# Altium project Mach_dieu khien tu xa 4 lop.PrjPcb
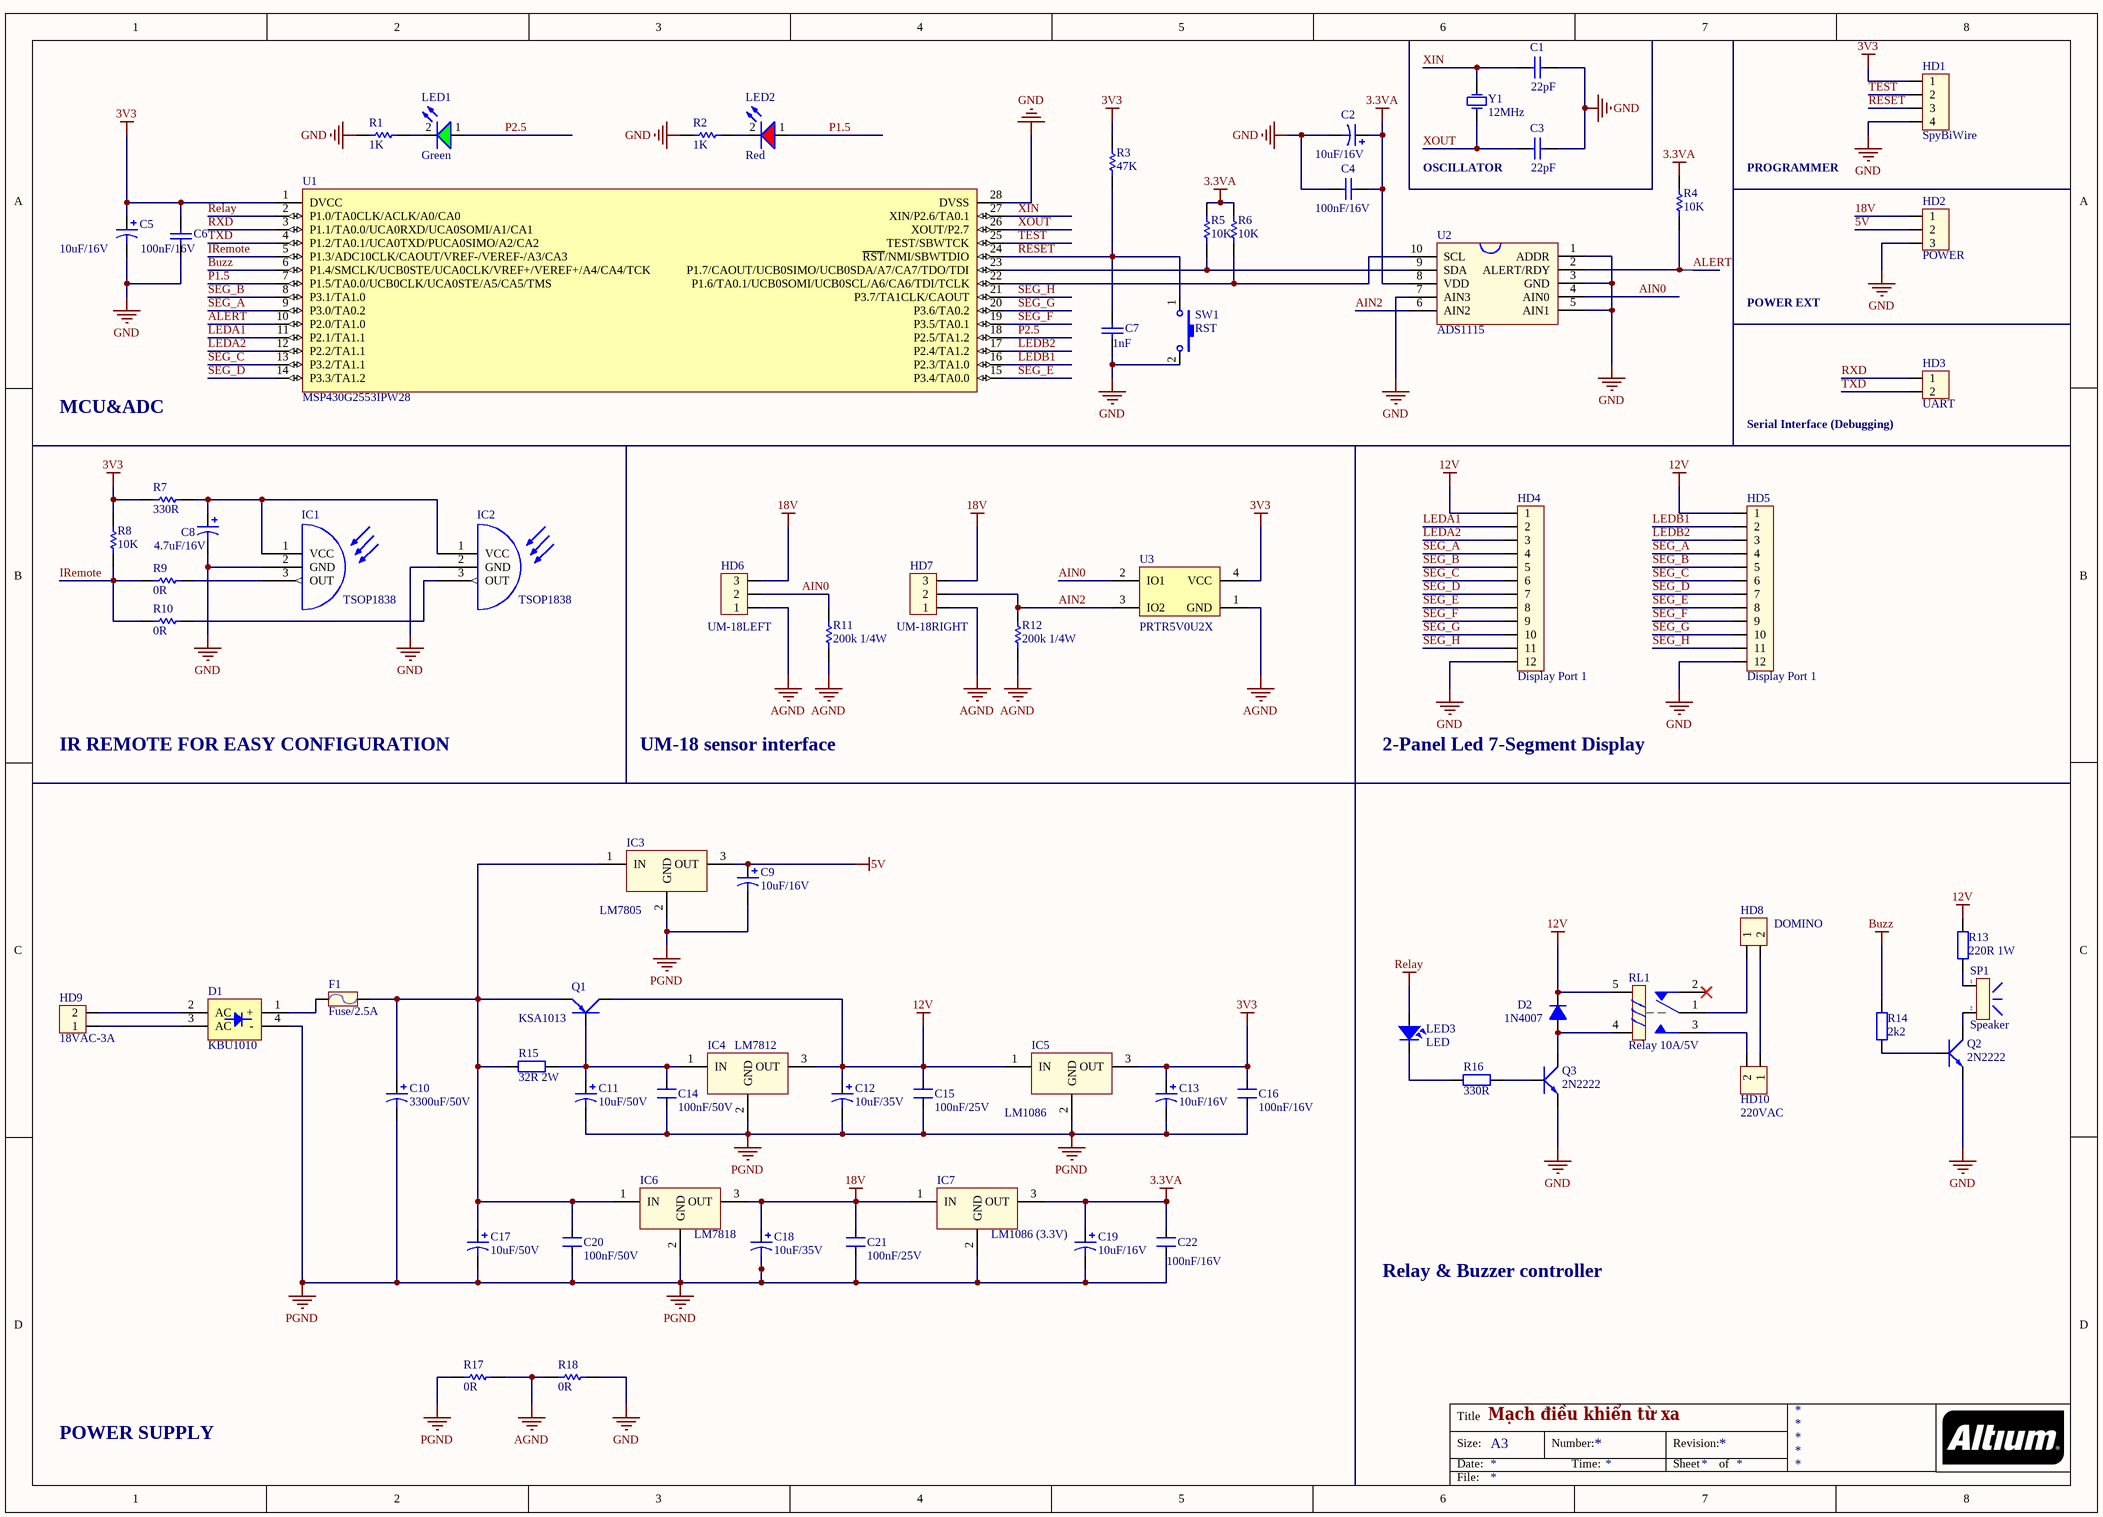
[diagram p0: Sheet1.SchDoc]
1 sheet, 73 parts. Net scope: global (net labels, ports and power ports of the same name join across sheets).
Board file: PCB1.PcbDoc

## Sheet Sheet1.SchDoc: Mạch điều khiển từ xa
size A3

### Parts
C1  22pF  [Tu gom 104]
C2  10uF/16V  [CAP_22UF_16V]
C3  22pF  [Tu gom 104]
C4  100nF/16V  [C0_1uF]
C5  10uF/16V  [CP_1]
C6  100nF/16V  [Tu gom 104]
C7  1nF  [Tu gom 104]
C8  4.7uF/16V  [CP_1]
C9  value 10uF/16V  [CP_1]  (hidden comment: Cap Pol1)
C10  value 3300uF/50V  [CAP_470UF_25V]  (hidden comment: Cap Pol1)
C11  value 10uF/50V  [CP_1]  (hidden comment: Cap Pol1)
C12  value 10uF/35V  [CP_1]  (hidden comment: Cap Pol1)
C13  value 10uF/16V  [CP_1]  (hidden comment: Cap Pol1)
C14  100nF/50V  [Tu gom 104]
C15  100nF/25V  [Tu gom 104]
C16  100nF/16V  [Tu gom 104]
C17  value 10uF/50V  [CP_1]  (hidden comment: Cap Pol1)
C18  value 10uF/35V  [CP_1]  (hidden comment: Cap Pol1)
C19  value 10uF/16V  [CP_1]  (hidden comment: Cap Pol1)
C20  100nF/50V  [Tu gom 104]
C21  100nF/25V  [Tu gom 104]
C22  100nF/16V  [Tu gom 104]
D1  KBU1010  [BRIDGE-10A]
D2  1N4007  [D2A]
F1  Fuse/2.5A  [FUSE2_5A]
HD1  SpyBiWire  [Header_4]
HD2  POWER  [HD-3]
HD3  UART  [HD2]
HD4  Display Port 1  [HD-12]
HD5  Display Port 1  [HD-12]
HD6  UM-18LEFT  [Header_3]
HD7  UM-18RIGHT  [Header_3]
HD8  DOMINO  [HDR-2GREEN]
HD9  18VAC-3A  [HDR-2GREEN]
HD10  220VAC  [HDR-2GREEN]
IC1  TSOP1838  [TSOP-1838]
IC2  TSOP1838  [TSOP-1838]
IC3  LM7805  [TO-220]
IC4  LM7812  [TO-220]
IC5  LM1086  [TO-220]
IC6  LM7818  [TO-220]
IC7  LM1086 (3.3V)  [TO-220]
LED1  value Green  [LED_0805_GREEN]  (hidden comment: LED_G_3)
LED2  value Red  [LED_0805_RED]  (hidden comment: LED_R_5)
LED3  LED  [LED_BLUE_5mm]
Q1  KSA1013  [TO92]
Q2  2N2222  [TO92]
Q3  2N2222  [TO92]
R1  1K  [R1/2W]
R2  1K  [R1/2W]
R3  47K  [R1/4W]
R4  10K  [R1/2W]
R5  10K  [R1/2W]
R6  10K  [R1/2W]
R7  330R  [R_0805]
R8  10K  [R1/2W]
R9  0R  [R1W]
R10  0R  [R1W]
R11  200k 1/4W  [R1/4W]
R12  200k 1/4W  [R1/4W]
R13  value 220R 1W  [R_0805]  (hidden comment: Res2)
R14  value 2k2  [R1/2W]  (hidden comment: Res2)
R15  value 32R 2W  [R_0805]  (hidden comment: Res2)
R16  value 330R  [R_0805]  (hidden comment: Res2)
R17  0R  [R1W]
R18  0R  [R1W]
RL1  Relay 10A/5V  [RL_SPDT_10A]
SP1  Speaker  [SPEAKER]
SW1  value RST  [SW-SMD]  (hidden comment: EVQ-PNF04M)
U1  MSP430G2553IPW28  [TSSOP-28]
U2  ADS1115  [TSSOP-10]
U3  PRTR5V0U2X  [SOT-143]
Y1  value 12MHz  [XTAL-12MHz]  (hidden comment: HC49S-20-C-30-30-F-20.000MHz)

### Nets
3.3VA: C2.1 C4.2 C19.1 C22.2 IC7.3(OUT) R4.2 R5.2 R6.2 U2.8(VDD)
3V3: C5.1 C6.2 C13.1 C16.2 HD1.1 IC5.3(OUT) R3.2 R7.1 R8.2 U1.1(DVCC) U3.4(VCC)
5V: C9.1 HD2.2 IC3.3(OUT)
12V: C12.1 C15.2 D2.2(K) HD4.1 HD5.1 IC4.3(OUT) IC5.1(IN) Q1.2(C) R13.2 RL1.5
18V: C18.1 C21.2 HD2.1 HD6.3 HD7.3 IC6.3(OUT) IC7.1(IN)
AGND: HD6.1 HD7.1 R11.1 R12.1 R17.2 R18.1 U3.1(GND)
Buzz: R14.1 U1.6(P1.4/SMCLK/UCB0STE/UCA0CLK/VREF+/VEREF+/A4/CA4/TCK)
GND: C1.2 C2.2 C3.2 C4.1 C5.2 C6.1 C7.1 C8.2 HD1.4 HD2.3 HD4.12 HD5.12 IC1.2(GND) IC2.2(GND) Q2.1(E) Q3.1(E) R1.2 R2.2 R18.2 SW1.2 U1.28(DVSS) U2.1(ADDR) U2.3(GND) U2.5(AIN1) U2.7(AIN3)
PGND: C9.2 C10.2 C11.2 C12.2 C13.2 C14.1 C15.1 C16.1 C17.2 C18.2 C19.2 C20.1 C21.1 C22.1 D1.4(-) IC3.2(GND) IC4.2(GND) IC5.2(GND) IC6.2(GND) IC7.2(GND) R17.1
Relay: LED3.1 U1.2(P1.0/TA0CLK/ACLK/A0/CA0)
AIN0: HD6.2 R11.2 U2.4(AIN0) U3.2(IO1)
AIN2: HD7.2 R12.2 U2.6(AIN2) U3.3(IO2)
ALERT: R4.1 U1.10(P2.0/TA1.0) U2.2(ALERT/RDY)
IRemote: R8.1 R9.1 R10.1 U1.5(P1.3/ADC10CLK/CAOUT/VREF-/VEREF-/A3/CA3)
LEDA1: HD4.2 U1.11(P2.1/TA1.1)
LEDA2: HD4.3 U1.12(P2.2/TA1.1)
LEDB1: HD5.2 U1.16(P2.3/TA1.0)
LEDB2: HD5.3 U1.17(P2.4/TA1.2)
P1.5: LED2.1(A) U1.7(P1.5/TA0.0/UCB0CLK/UCA0STE/A5/CA5/TMS)
P2.5: LED1.1(A) U1.18(P2.5/TA1.2)
RESET: C7.2 HD1.3 R3.1 SW1.1 U1.24(~{RST}/NMI/SBWTDIO)
RXD: HD3.1 U1.3(P1.1/TA0.0/UCA0RXD/UCA0SOMI/A1/CA1)
SEG_A: HD4.4 HD5.4 U1.9(P3.0/TA0.2)
SEG_B: HD4.5 HD5.5 U1.8(P3.1/TA1.0)
SEG_C: HD4.6 HD5.6 U1.13(P3.2/TA1.1)
SEG_D: HD4.7 HD5.7 U1.14(P3.3/TA1.2)
SEG_E: HD4.8 HD5.8 U1.15(P3.4/TA0.0)
SEG_F: HD4.9 HD5.9 U1.19(P3.5/TA0.1)
SEG_G: HD4.10 HD5.10 U1.20(P3.6/TA0.2)
SEG_H: HD4.11 HD5.11 U1.21(P3.7/TA1CLK/CAOUT)
TEST: HD1.2 U1.25(TEST/SBWTCK)
TXD: HD3.2 U1.4(P1.2/TA0.1/UCA0TXD/PUCA0SIMO/A2/CA2)
XIN: C1.1 U1.27(XIN/P2.6/TA0.1) Y1.2(OSC2)
XOUT: C3.1 U1.26(XOUT/P2.7) Y1.1(OSC1)
NetC8_1: C8.1 IC1.1(VCC) IC2.1(VCC) R7.2
NetC10_1: C10.1 C17.1 C20.2 F1.2 IC3.1(IN) IC6.1(IN) Q1.1(E) R15.1
NetC11_1: C11.1 C14.2 IC4.1(IN) Q1.3(B) R15.2
NetD1_1: D1.1(+) F1.1
NetD1_2: D1.2(AC) HD9.2
NetD1_3: D1.3(AC) HD9.1
NetD2_1: D2.1(A) Q3.3(C) RL1.4
NetHD8_1: HD8.1 RL1.1
NetHD8_2: HD8.2 HD10.1
NetHD10_2: HD10.2 RL1.3
NetIC1_3: IC1.3(OUT) R9.2
NetIC2_3: IC2.3(OUT) R10.2
NetLED1_2: LED1.2(K) R1.1
NetLED2_2: LED2.2(K) R2.1
NetLED3_2: LED3.2 R16.2
NetQ2_2: Q2.2(B) R14.2
NetQ2_3: Q2.3(C) SP1.2
NetQ3_2: Q3.2(B) R16.1
NetR5_1: R5.1 U1.23(P1.7/CAOUT/UCB0SIMO/UCB0SDA/A7/CA7/TDO/TDI) U2.9(SDA)
NetR6_1: R6.1 U1.22(P1.6/TA0.1/UCB0SOMI/UCB0SCL/A6/CA6/TDI/TCLK) U2.10(SCL)
NetR13_1: R13.1 SP1.1

Not connected (* = marked no-connect by the designer): RL1 2*

### Notes on the sheet
- OSCILLATOR
- PROGRAMMER
- POWER EXT
- MCU&ADC
- (near HD3) Serial Interface (Debugging)
- IR REMOTE FOR EASY CONFIGURATION
- UM-18 sensor interface
- 2-Panel Led 7-Segment Display
- Relay & Buzzer controller
- POWER SUPPLY
- Title
- Size:
- Date:
- A3
- Number:
- Time:
- Revision:
- Sheet
- of
- File:

### Library data of the parts
C1 C3 C4 C6 C7 = 10nF/50V/C0603/10%: CAP CER 10000PF 50V X7R 0603; Manufacturer: Murata Electronics North America; Manufacturer Part Number: GRM188R71H103KA01D; Tolerance: ±10%; RoHS: RoHS Compliant; Category: Capacitors; Packaging: Cut Tape (CT); Capacitance: 10000pF; Voltage - Rated: 50V; Temperature Coefficient: X7R; Mounting Type: Surface Mount, MLCC; Operating Temperature: -55°C ~ 125°C; Applications: General Purpose; Ratings: -; Package / Case: 0603 (1608 Metric); Size / Dimension: 0.063" L x 0.031" W (1.60mm x 0.80mm); Height - Seated (Max): -; Thickness (Max): 0.035" (0.90mm); Lead Spacing: -; Features: -; Lead Style: -; ComponentLink1URL: http://www.murata.com/~/media/webrenewal/support/library/catalog/products/capacitor/mlcc/c02e.ashx; ComponentLink1Description: http://www.murata.com/~/media/webrenewal/support/library/catalog/products/capacitor/mlcc/c02e.ashx; Supplier 1: Digi-Key; Supplier Part Number 1: 490-1512-1-ND
C2 C5 C8 = 100uF/6.3V/SIZE B/20%: CAP TANT 100UF 6.3V 20% 1411; Manufacturer: Kemet; Manufacturer Part Number: T491B107M006AT; Manufacturer Size Code: B; Capacitance: 100µF; ESR (Equivalent Series Resistance): 3 Ohm; Type: Molded; Lifetime @ Temp.: 2000 Hrs @ 85°C; RoHS: RoHS Compliant; Category: Capacitors; Packaging: Cut Tape (CT); Tolerance: ±20%; Voltage - Rated: 6.3V; Operating Temperature: -55°C ~ 125°C; Mounting Type: Surface Mount; Package / Case: 1411 (3528 Metric); Size / Dimension: 0.138" L x 0.110" W (3.50mm x 2.80mm); Height - Seated (Max): 0.083" (2.10mm); Lead Spacing: -; Features: General Purpose; ComponentLink1URL: http://www.kemet.com/Lists/ProductCatalog/Attachments/254/KEM_T2005_T491.pdf; ComponentLink1Description: http://www.kemet.com/Lists/ProductCatalog/Attachments/254/KEM_T2005_T491.pdf; Supplier 1: Digi-Key; Supplier Part Number 1: 399-3710-1-ND
C9-C13 C17-C19 = Cap Pol1: Polarized Capacitor (Radial); Published: 8-Jun-2000; LatestRevisionDate: 17-Jul-2002; LatestRevisionNote: Re-released for DXP Platform.; PackageReference: RB7.6-15; Publisher: Altium Limited; PackageDescription: Polarized Capacitor (Radial); 2 Leads
C14-C16 C20-C22 = CN2: Cap np 104 => 105pF; Value: 0.1uF
D1 = KBU1010: 10A glass passivated bridge rectifier; Digikey: http://www.digikey.com/product-detail/en/KBU1010-G/641-1359-ND/2074824; datasheet: http://www.comchiptech.com/cms/UserFiles/KBU10005-G%20Thru.%20KBU1010-G%20Series%20RevA.pdf
D2 = D1A: Diode 1A; Value: 1N4007
F1 = Fuse: Designed by: VanDungEvn; Value: Fuse
HD1 = Hed4: Header 4 (Green); Value: Header 4
HD2 HD6 HD7 = Hed3: Header 3 (Green); Value: Header 3
HD3 HD8-HD10 = Hed2: Header 2 (Green); Value: Header 2
HD4 HD5 = Hed12: Header 12; Value: Header 5
IC3-IC5 = LM78xx: Linear Regulator; Value: LM7818; digikey: http://www.digikey.com/product-detail/en/LM7818CT/LM7818CT-ND/1923054; datasheet: http://www.fairchildsemi.com/ds/LM/LM7805.pdf
IC6 IC7 = LM78xx: Linear Regulator
  IC6: Value: LM7818; digikey: http://www.digikey.com/product-detail/en/LM7818CT/LM7818CT-ND/1923054; datasheet: http://www.fairchildsemi.com/ds/LM/LM7805.pdf
  IC7: Value: LM1086 (3.3V); digikey: http://www.digikey.com/product-detail/en/LM1086CSX-3.3%2FNOPB/LM1086CSX-3.3%2FNOPBCT-ND/3440095; datasheet: http://www.ti.com/lit/ds/symlink/lm1086.pdf
LED1 = LED_GREEN_3MM: LED Green 3mm; ComponentLink1Description: Datasheet; ComponentLink1URL: D:\Dropbox\Datasheets\Opto and Illumination\LEDs\SMD LED.pdf; Unit Price: 0.0476
LED2 = LED_RED_5MM: LED Red 5mm; ComponentLink1Description: Datasheet; ComponentLink1URL: D:\Dropbox\Datasheets\Opto and Illumination\LEDs\SMD LED.pdf; Unit Price: 0.0476
LED3 = LED: LED Single colour Green and Red; Value: LED 3 ly Single Colour
Q1 = A1015: PNP 600mW, ECB; Manufacturer: Fairchild Semiconductor; Value: KSA1013; Digikey: http://www.digikey.com/product-detail/en/KSA1013YBU/KSA1013YBUFS-ND/1048937; Datasheet: http://www.fairchildsemi.com/ds/KS/KSA1013.pdf
Q2 Q3 = C1815: TRANS GP SS NPN LP 40V TO92; Value: P2N2222AG; digikey: http://www.digikey.com/product-detail/en/P2N2222AG/P2N2222AGOS-ND/920244
R1-R12 R17 R18 = 10K/R0603/1%: RES SMD 10K OHM 1% 1/10W 0603; Manufacturer: Yageo; Manufacturer Part Number: RC0603FR-0710KL; Power (Watts): 0.1W, 1/10W; Temperature Coefficient: ±100ppm/°C; Supplier 1: Digi-Key; RoHS: RoHS Compliant; Category: Resistors; Stock 1: 11440000; Pricing 1: 5000=0.00167, 10000=0.00145, 25000=0.00128, 50000=0.00117, 125000=0.00115 (USD); Packaging: Tape & Reel (TR); Resistance (Ohms): 10k; Tolerance: ±1%; Composition: Thick Film; Features: Moisture Resistant; Operating Temperature: -55°C ~ 155°C; Package / Case: 0603 (1608 Metric); Supplier Device Package: 0603; Size / Dimension: 0.063" L x 0.031" W (1.60mm x 0.80mm); Height: 0.022" (0.55mm); Number of Terminations: 2; ComponentLink1URL: http://www.yageo.com/NewPortal/yageodocoutput?fileName=/pdf/R-Chip/PYu-RC_Group_51_RoHS_L_3.pdf; ComponentLink1Description: http://www.yageo.com/NewPortal/yageodocoutput?fileName=/pdf/R-Chip/PYu-RC_Group_51_RoHS_L_3.pdf; Supplier Part Number 1: 311-10.0KHRTR-ND
R13-R16 = Res2: Resistor; Published: 8-Jun-2000; LatestRevisionDate: 17-Jul-2002; LatestRevisionNote: Re-released for DXP Platform.; PackageReference: AXIAL-0.4; Publisher: Altium Limited; PackageDescription: Axial Device, Thru-Hole; 2 Leads; 0.4 in Pin Spacing
RL1 = Relay 1: Relay SPDT,10A - 12VDC 5 Pin; Value: Relay SPDT, 10A, 12V
SP1 = SPK: Speaker Chip; Value: Speaker Chip
SW1 = SW EVQ-PNF04M: Switch smd, 2PIN 6x4mm; Published: 24-Mar-1999; LatestRevisionDate: 17-Jul-2002; LatestRevisionNote: Re-released for DXP Platform.; PackageReference: SPST-2; Publisher: Altium Limited
U1 = MSP430G2553IPW28: MCU 16bit 16KB 1.8-3.6V 16MHz TSSOP28; ComponentLink1Description: Datasheet; ComponentLink1URL: D:\Dropbox\Datasheets\Microcontrolers\MSP430\MSP430x2xx Family\MSP430G2553.pdf; Unit Price: 1.0000
U3 = PRTR5V0U2X: ESD protection diode; digikey: http://www.digikey.com/product-detail/en/PRTR5V0U2X,215/568-4140-1-ND/1589981; datasheet: http://www.nxp.com/documents/data_sheet/PRTR5V0U2X.pdf
Y1 = HC49S-20-C-30-30-F-20.000MHz: Crystal Oscillator 30ppm 20.000MHz; ComponentLink1Description: Datasheet; ComponentLink1URL: D:\Dropbox\Datasheets\Passive Components\Crystals\HC49S.pdf; Unit Price: 0.0440